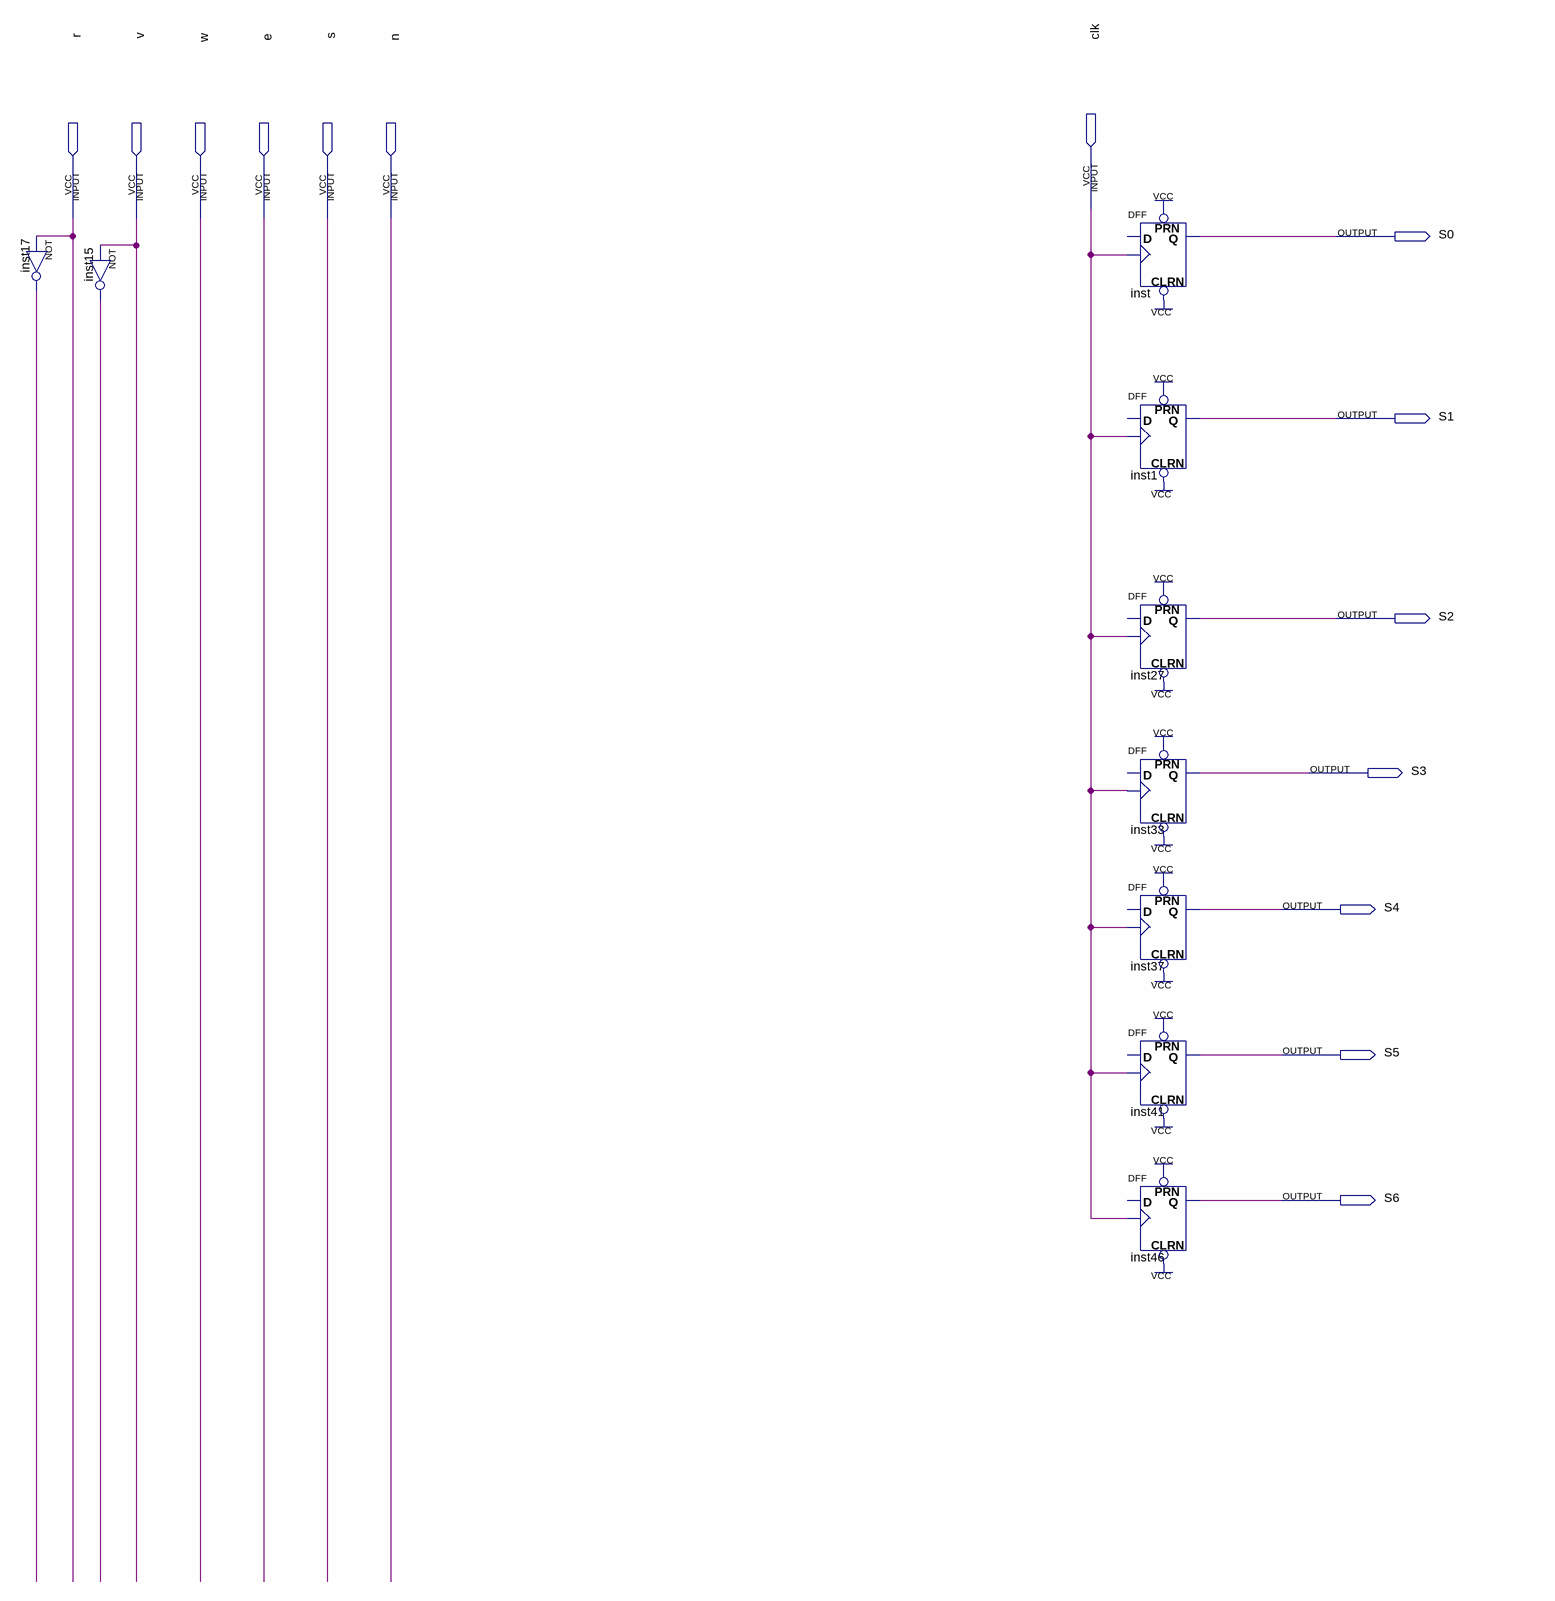
[diagram p0: schematic sheet]
// Quartus schematic room (copy 1).bdf as structural Verilog: 9 symbols, 14 pins
module \room_(copy_1)  (
  input  clk,
  input  r,
  input  v,
  input  w,
  input  e,
  input  s,
  input  n,
  output S0,
  output S1,
  output S2,
  output S3,
  output S4,
  output S5,
  output S6
);

  wire inst15_out, inst17_out;

  not inst17 (inst17_out, r);
  not inst15 (inst15_out, v);
  DFF inst (.CLRN(1'b1), .CLK(clk), .PRN(1'b1), .Q(S0));  // open: D
  DFF inst1 (.CLRN(1'b1), .CLK(clk), .PRN(1'b1), .Q(S1));  // open: D
  DFF inst27 (.CLRN(1'b1), .CLK(clk), .PRN(1'b1), .Q(S2));  // open: D
  DFF inst33 (.CLRN(1'b1), .CLK(clk), .PRN(1'b1), .Q(S3));  // open: D
  DFF inst37 (.CLRN(1'b1), .CLK(clk), .PRN(1'b1), .Q(S4));  // open: D
  DFF inst41 (.CLRN(1'b1), .CLK(clk), .PRN(1'b1), .Q(S5));  // open: D
  DFF inst46 (.CLRN(1'b1), .CLK(clk), .PRN(1'b1), .Q(S6));  // open: D
endmodule
